# Altium schematic sheet Sensor.SchDoc
size A
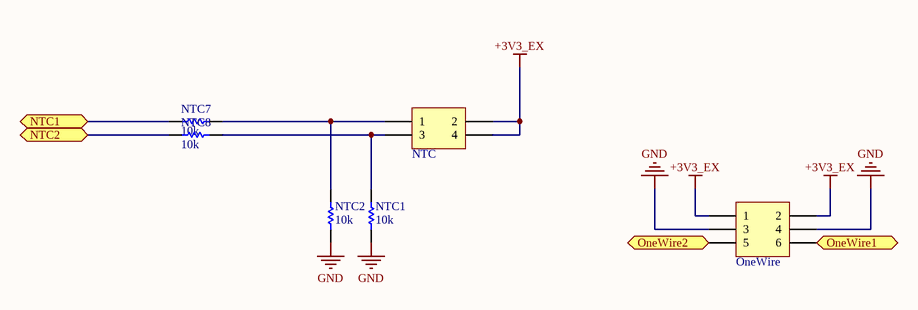
[diagram p0: Sensor.SchDoc]

## Parts
NTC  Header 2X2  [HDR2X2]  (value not drawn)
NTC1  value 10k  [RESC1608N_ZERO]  (hidden comment: Res)
NTC2  value 10k  [RESC1608N_ZERO]  (hidden comment: Res)
NTC7  value 10k  [RESC1608N_ZERO]  (hidden comment: Res)
NTC8  value 10k  [RESC1608N_ZERO]  (hidden comment: Res)
OneWire  Header 3X2  [HDR2X3]  (value not drawn)

## Ports
NTC1, NTC2, OneWire1, OneWire2

## Nets
+3V3_EX: NTC.2 NTC.4 OneWire.1 OneWire.2
GND: NTC1.1 NTC2.1 OneWire.3 OneWire.4
NTC1: NTC7.2 ; port NTC1
NTC2: NTC8.2 ; port NTC2
OneWire1: OneWire.6 ; port OneWire1
OneWire2: OneWire.5 ; port OneWire2
NetNTC_1: NTC.1 NTC2.2 NTC7.1
NetNTC_3: NTC.3 NTC1.2 NTC8.1

## Library data of the parts
NTC = Header 2X2: Header, 2-Pin, Dual row; LatestRevisionDate: 17-Jul-2002; LatestRevisionNote: Re-released for DXP Platform.; Publisher: Altium Limited
OneWire = Header 3X2: Header, 3-Pin, Dual row; LatestRevisionDate: 17-Jul-2002; LatestRevisionNote: Re-released for DXP Platform.; Publisher: Altium Limited